# Altium schematic sheet 02_MCU.SchDoc
size A; SheetNumber: 3; SheetTotal: 6
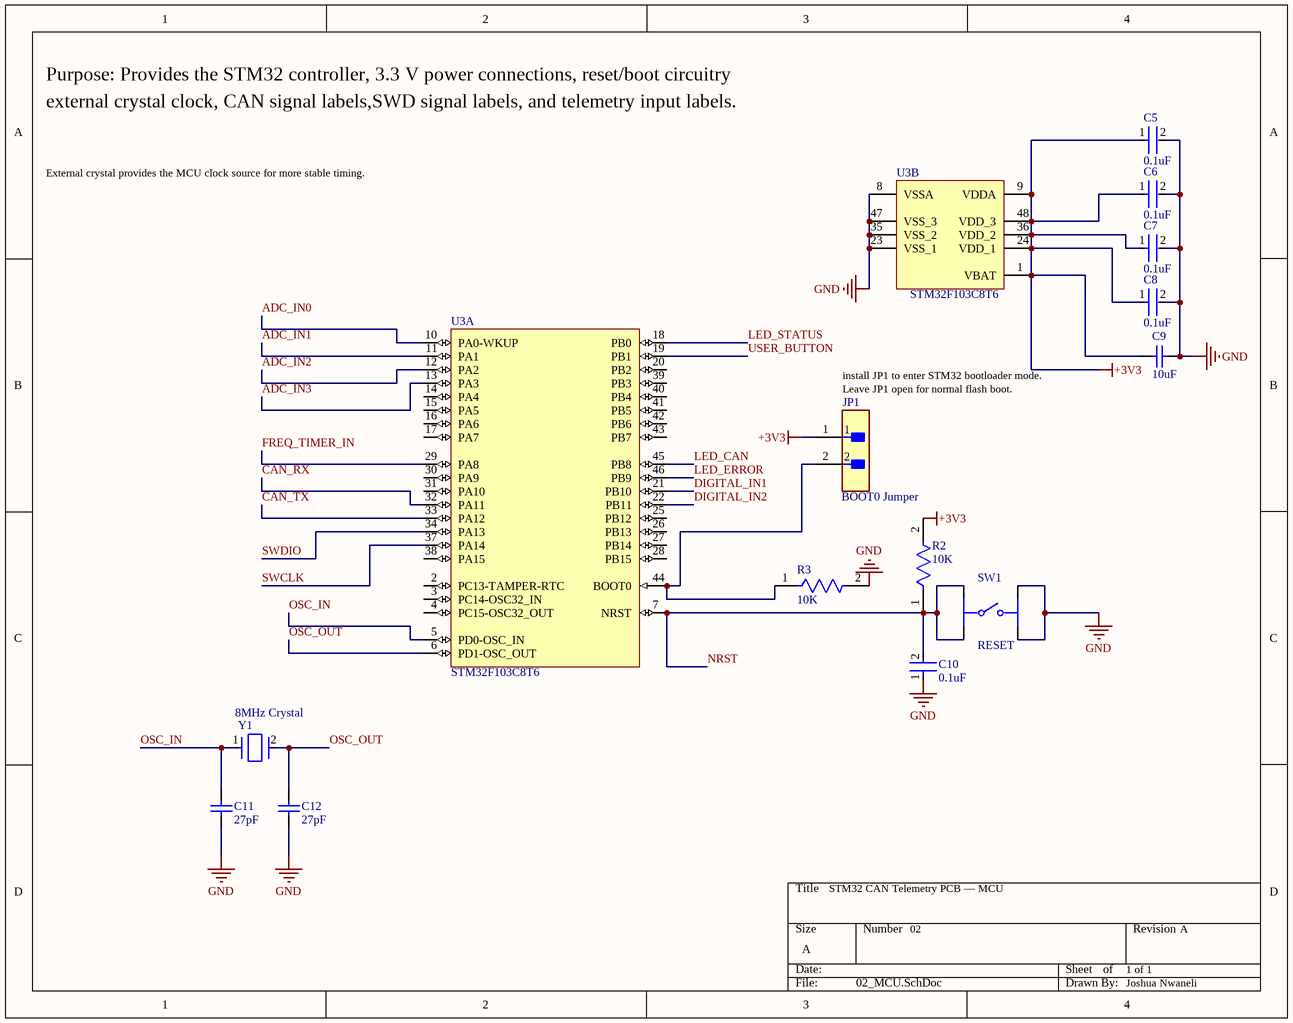
[diagram p0: 02_MCU.SchDoc]

## Parts
C5  0.1uF  [FP-CC0805-EB-MFG]
C6  0.1uF  [FP-CC0805-EB-MFG]
C7  0.1uF  [FP-CC0805-EB-MFG]
C8  0.1uF  [FP-CC0805-EB-MFG]
C9  10uF  [CAPC2013X140X50ML20T25]
C10  0.1uF  [FP-CC0805-EB-MFG]
C11  27pF  [CAPC0603X33X15ML03T05]
C12  27pF  [CAPC0603X33X15ML03T05]
JP1  BOOT0 Jumper  [FP-TSW-102-12-T-S-MFG]
R2  10K  [FP-CRGP0805-IPC_C]
R3  10K  [FP-CRGP0805-IPC_C]
SW1  RESET  [FP-7914J-1-032-MFG]
U3  STM32F103C8T6  [STM-LQFP48_L]  (parts A,B of 2)
Y1  8MHz Crystal  [FP-ABLS-MFG]

## Nets
+3V3: C5.1 C6.1 C7.1 C8.1 C9.2 JP1.1 R2.2 U3.1(VBAT) U3.9(VDDA) U3.24(VDD_1) U3.36(VDD_2) U3.48(VDD_3)
GND: C5.2 C6.2 C7.2 C8.2 C9.1 C10.1 C11.1 C12.1 R3.2 SW1.1_2+(1_2+) SW1.2_2+(2_2+) U3.8(VSSA) U3.23(VSS_1) U3.35(VSS_2) U3.47(VSS_3)
ADC_IN0: U3.10(PA0-WKUP)
ADC_IN1: U3.11(PA1)
ADC_IN2: U3.12(PA2)
ADC_IN3: U3.13(PA3)
CAN_RX: U3.32(PA11)
CAN_TX: U3.33(PA12)
DIGITAL_IN1: U3.21(PB10)
DIGITAL_IN2: U3.22(PB11)
FREQ_TIMER_IN: U3.29(PA8)
LED_CAN: U3.45(PB8)
LED_ERROR: U3.46(PB9)
LED_STATUS: U3.18(PB0)
NRST: C10.2 R2.1 SW1.1_1-(1_1-) SW1.2_1-(2_1-) U3.7(NRST)
OSC_IN: C11.2 U3.5(PD0-OSC_IN) Y1.1
OSC_OUT: C12.2 U3.6(PD1-OSC_OUT) Y1.2
SWCLK: U3.37(PA14)
SWDIO: U3.34(PA13)
USER_BUTTON: U3.19(PB1)
NetJP1_2: JP1.2 R3.1 U3.44(BOOT0)

Not connected (* = marked no-connect by the designer): U3 2(PC13-TAMPER-RTC) 3(PC14-OSC32_IN) 4(PC15-OSC32_OUT) 14(PA4) 15(PA5) 16(PA6) 17(PA7) 20(PB2) 25(PB12) 26(PB13) 27(PB14) 28(PB15) 30(PA9) 31(PA10) 38(PA15) 39(PB3) 40(PB4) 41(PB5) 42(PB6) 43(PB7)

## Notes on the sheet
- Purpose: Provides the STM32 controller, 3.3 V power connections, reset/boot circuitry
- external crystal clock, CAN signal labels,SWD signal labels, and telemetry input labels.
- External crystal provides the MCU clock source for more stable timing.
- install JP1 to enter STM32 bootloader mode.
- (near JP1) Leave JP1 open for normal flash boot.
- STM32 CAN Telemetry PCB — MCU
- 02
- 1 of 1
- A
- Joshua Nwaneli

## Library data of the parts
C5-C8 C10 = CMP-00621-107850848-1: CC0805KKX7RYBB104 Capacitor Ceramic 0.01uF 250V X7R 10% 0805 T/R; Capacitance: 100nF; Material: Ceramic; Max Operating Temperature: 125°C; Tolerance: 10%; Case/Package: 0805; NexarPartId: 107850848; Height: 1.45mm; Min Operating Temperature: -55°C; Voltage Rating: 250V
C9 = CMP-2007-04702-1: Manufacturer: AVX Interconnect / Elco; Part Number: 0805ZC106KAT2A
C11 C12 = CMP-2010-00173-1: Manufacturer: AVX Interconnect / Elco; Part Number: 0201YA270JAT2A
JP1 = CMP-02766-001444-1: CONN HEADER VERT 2POS 2.54MM; Gender: Male; Number of Contacts: 2; RoHS Compliant: Yes; Mount: Through Hole; Termination: Solder; Packaging: Bulk; Contact Material: Bronze; Contact Plating: Tin; Number of Rows: 1; REACH SVHC: No SVHC; Pitch: 2.54mm; Radiation Hardening: No
R2 R3 = CMP-03211-006861-1: CRGP 0805 10K 1%; Manufacturer Part Number: CRGP0805F10K; Manufacturer: TE; Power Rating: 0.33W; Description: CRGP0805 10KΩ 0.33W ±100ppm/°C 1% 150V; Voltage Rating: 150V; Value: 10KΩ; Tolerance: 0.01; Temperature Coefficient: ±100ppm/°C; ComponentLink2URL: https://www.mouser.com/datasheet/2/418/NG_DS_9-1773463-9_A-1358566.pdf; Temperature Range Low: -55°C; Ipc Land Pattern Name: RESC200125X55; Device Class L2: Resistors; Automotive: No; Device Class L3: Chip SMD Resistors; Composition: Thick Film; Temperature Range High: +155°C; Temperature: -55°C to +155°C; Height: 0.65mm; Series: CRGP; RoHS: TRUE; Device Class L1: Passive Components; Octopart: https://octopart.com/crgp0805f10k-te+connectivity-91018782; Package: CRGP0805; Digikey Description: CRGP 0805 10K 1%; Ambient Temperature Range High: +70°C; Lead Free: Yes; ComponentLink2Description: Datasheet; Category: Res; Resistance: 10KΩ
SW1 = CMP-07427-000007-1: Normally open reset pushbutton for STM32 NRST; Mechanical Life: 100000Cycles; Switch Function: Off-Mom; Actuator Material: Rubber; Illumination Type: Non-Illuminated; Actuator Type: Standard; Operating Force: 300gf; Throw Configuration: SPST; Current Rating: 100mA; Voltage Rating (DC): 16V; Contact Plating: Silver; Min Operating Temperature: -55°C; Series: 7914; Package Quantity: 50; Max Operating Temperature: 125°C; Depth: 5mm; Termination: J-Hook; Mount: Surface Mount; RoHS Compliant: Yes; Case/Package: SMD/SMT; Orientation: Straight; Max Current Rating: 100mA; Packaging: Rail/Tube; Length: 5mm; Contact Material: Gold
U3 = CMP-0237-00215-3: ARM Cortex-M3 32-bit MCU, 64 KB Flash, 20 KB Internal RAM, 37 I/Os, 48-pin LQFP, -40 to 85 degC, Tray; Supply Voltage(Vcc) min (V): 2; Internal RAM Size (kB): 20; FLASH Size (Prog) (kB): 64; A/D Converter: 2x12-bit (10 Channel); I/Os (High Current): 37; Operating Frequency(F) (Processor speed) (MHz): 72; Core: ARM Cortex-M3; ComponentLink3Description: Package Specification; Mounting Technology: Surface Mount; PartNumber: STM32F103C8T6; PackageReference: LQFP48; Packing: Tray; ComponentLink3URL: http://www.st.com/st-web-ui/static/active/en/resource/technical/document/datasheet/DM00058181.pdf; DatasheetVersion: Rev. 16; ComponentLink1URL: http://www.st.com/web/en/home.html; PackageVersion: Rev. 6, 06/2013; ComponentLink2URL: http://www.st.com/st-web-ui/static/active/en/resource/technical/document/datasheet/CD00161566.pdf; ComponentLink1Description: Manufacturer URL; ComponentLink2Description: Datasheet; PackageDescription: 48-Pin Low Profile Quad Flat Package, 7 x 7 mm Body, 0.5 mm Pitch
Y1 = CMP-27762-009874-1: CRYSTAL 8.0000MHZ 18PF SMD; ESR (Equivalent Series Resistance): 80R; Frequency Stability: 50ppm; Tolerance: 20ppm; Min Operating Temperature: -20°C; Lead Free: Lead Free; Operating Frequency: 8 MHz; Width: 4.7mm; Packaging: Tape and Reel; Series: ABLS; Accuracy: 20ppm; Length: 11.4mm; Frequency Tolerance: 20ppm; Termination: SMD/SMT; Number of Pins: 2; Radiation Hardening: No; Depth: 4.7mm; REACH SVHC: No SVHC; Contact Plating: Tin; Load Capacitance: 18pF; Case/Package: SMD/SMT; Mount: Surface Mount; Package Quantity: 1000; Max Operating Temperature: 70°C; Height: 0.165inch; Frequency: 8MHz; Series Resistance: 80R